# EAGLE design 7_cpu_registers_b (EAGLE 6.6.0)

## Sheet 1 of 2
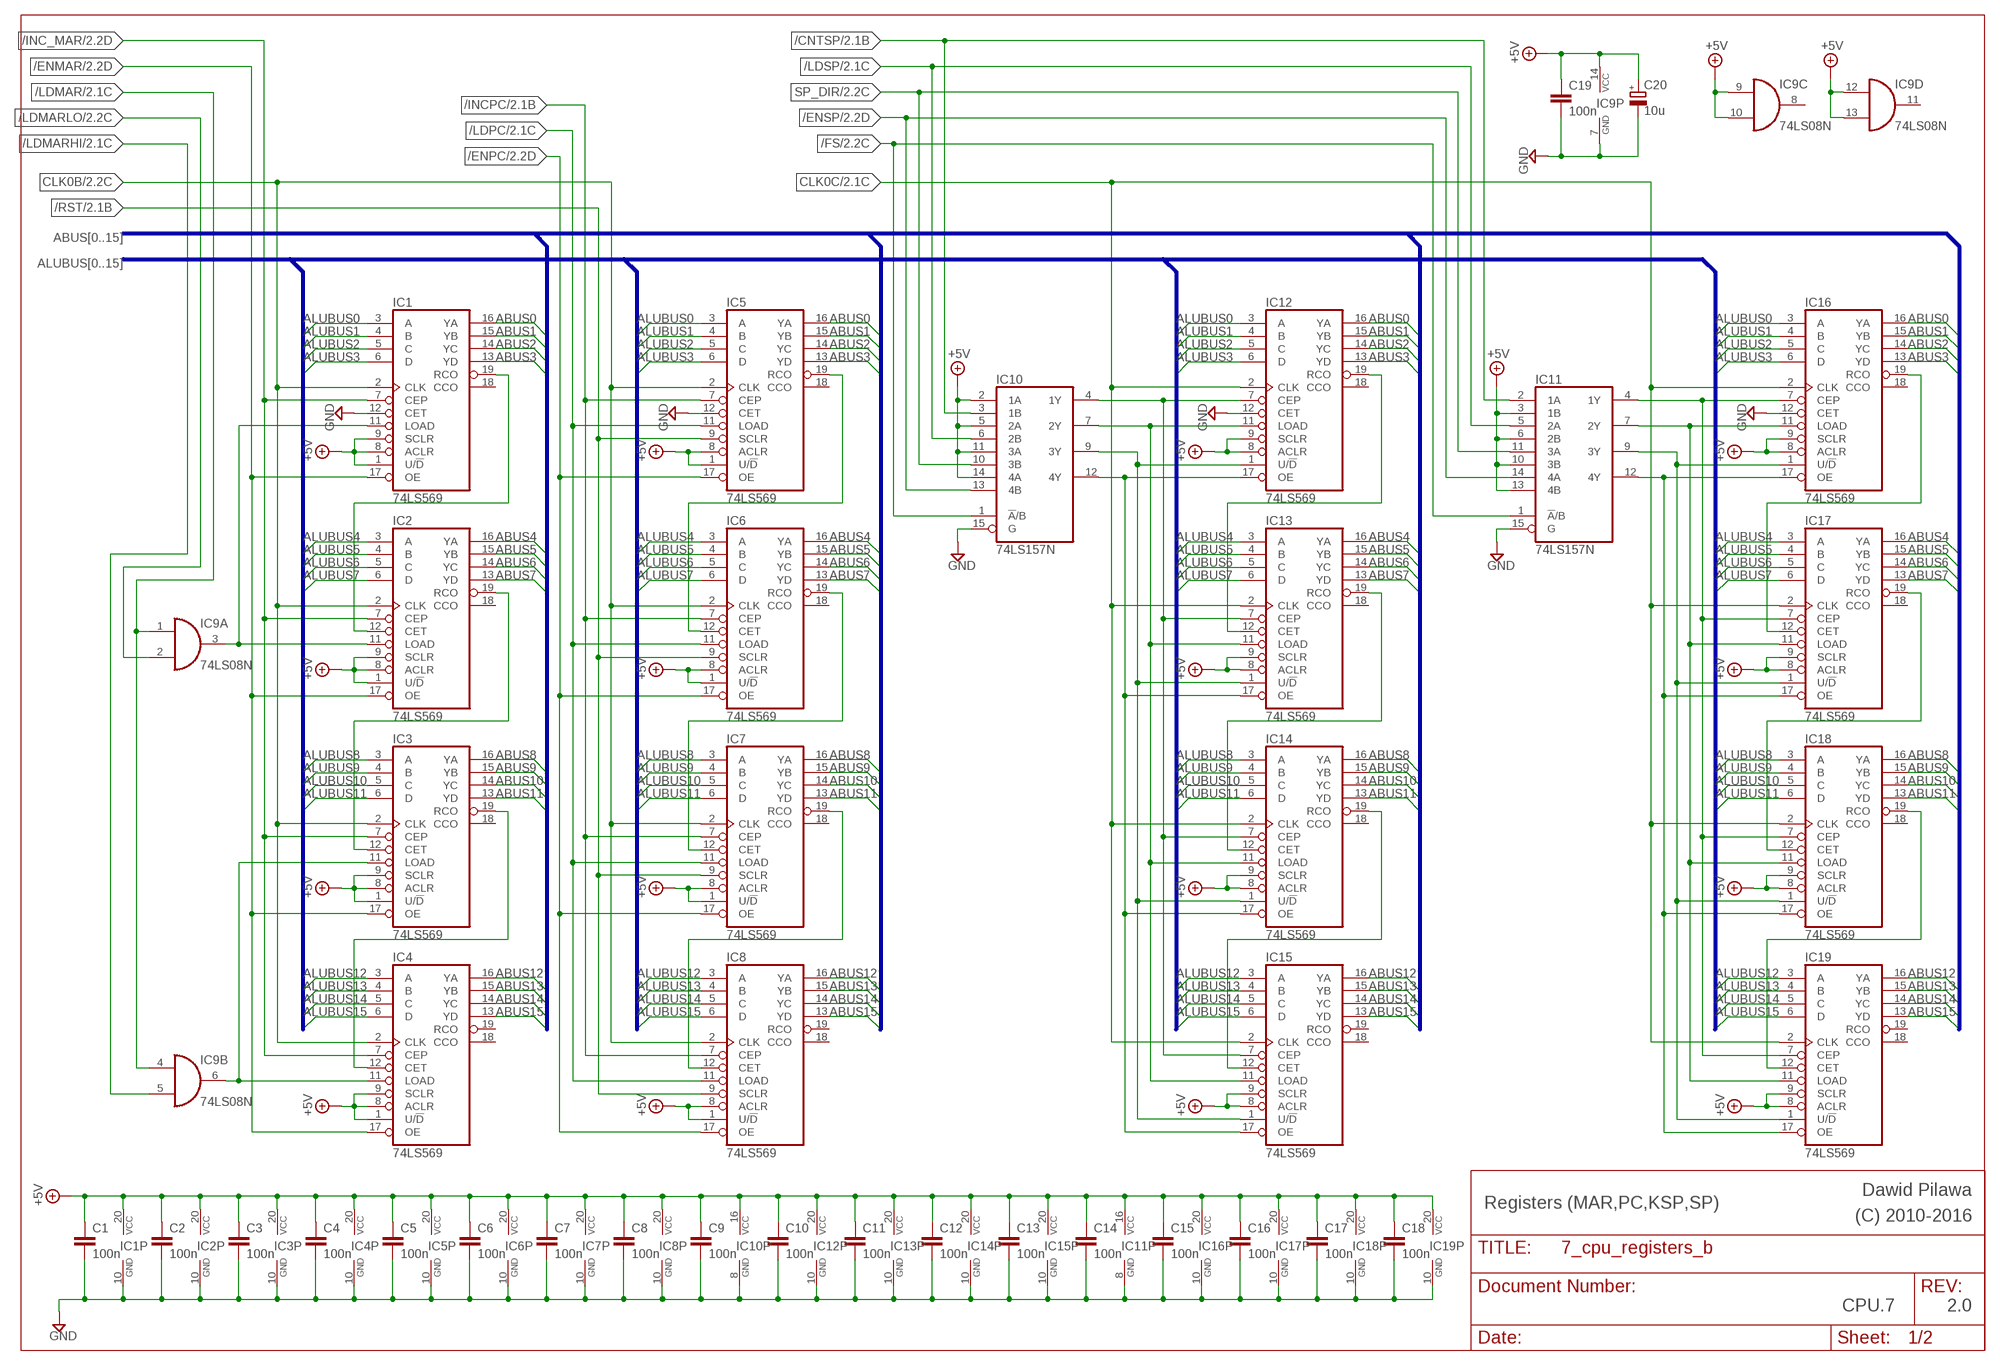
[diagram p0: schematic, sheet 1]

### Parts
C1  100n  C-EU050-024X044  [C050-024X044]
C2  100n  C-EU050-024X044  [C050-024X044]
C3  100n  C-EU050-024X044  [C050-024X044]
C4  100n  C-EU050-024X044  [C050-024X044]
C5  100n  C-EU050-024X044  [C050-024X044]
C6  100n  C-EU050-024X044  [C050-024X044]
C7  100n  C-EU050-024X044  [C050-024X044]
C8  100n  C-EU050-024X044  [C050-024X044]
C9  100n  C-EU050-024X044  [C050-024X044]
C10  100n  C-EU050-024X044  [C050-024X044]
C11  100n  C-EU050-024X044  [C050-024X044]
C12  100n  C-EU050-024X044  [C050-024X044]
C13  100n  C-EU050-024X044  [C050-024X044]
C14  100n  C-EU050-024X044  [C050-024X044]
C15  100n  C-EU050-024X044  [C050-024X044]
C16  100n  C-EU050-024X044  [C050-024X044]
C17  100n  C-EU050-024X044  [C050-024X044]
C18  100n  C-EU050-024X044  [C050-024X044]
C19  100n  C-EU050-024X044  [C050-024X044]
C20  10u  CPOL-EUE2.5-6  [E2,5-6]
IC1  74LS569  [DIL20]
IC2  74LS569  [DIL20]
IC3  74LS569  [DIL20]
IC4  74LS569  [DIL20]
IC5  74LS569  [DIL20]
IC6  74LS569  [DIL20]
IC7  74LS569  [DIL20]
IC8  74LS569  [DIL20]
IC9  74LS08N  [DIL14]
IC10  74LS157N  [DIL16]
IC11  74LS157N  [DIL16]
IC12  74LS569  [DIL20]
IC13  74LS569  [DIL20]
IC14  74LS569  [DIL20]
IC15  74LS569  [DIL20]
IC16  74LS569  [DIL20]
IC17  74LS569  [DIL20]
IC18  74LS569  [DIL20]
IC19  74LS569  [DIL20]

### Nets
+5V: C1.1 C2.1 C3.1 C4.1 C5.1 C6.1 C7.1 C8.1 C9.1 C10.1 C11.1 C12.1 C13.1 C14.1 C15.1 C16.1 C17.1 C18.1 C19.1 C20.+ IC1.1(U/!D) IC1.8(ACLR) IC1.9(SCLR) IC1.20(VCC) IC2.1(U/!D) IC2.8(ACLR) IC2.9(SCLR) IC2.20(VCC) IC3.1(U/!D) IC3.8(ACLR) IC3.9(SCLR) IC3.20(VCC) IC4.1(U/!D) IC4.8(ACLR) IC4.9(SCLR) IC4.20(VCC) IC5.1(U/!D) IC5.8(ACLR) IC5.20(VCC) IC6.1(U/!D) IC6.8(ACLR) IC6.20(VCC) IC7.1(U/!D) IC7.8(ACLR) IC7.20(VCC) IC8.1(U/!D) IC8.8(ACLR) IC8.20(VCC) IC9.9(C:I0) IC9.10(C:I1) IC9.12(D:I0) IC9.13(D:I1) IC9.14(P:VCC) IC10.2(1A) IC10.5(2A) IC10.11(3A) IC10.14(4A) IC10.16(VCC) IC11.3(1B) IC11.6(2B) IC11.10(3B) IC11.13(4B) IC11.16(VCC) IC12.8(ACLR) IC12.9(SCLR) IC12.20(VCC) IC13.8(ACLR) IC13.9(SCLR) IC13.20(VCC) IC14.8(ACLR) IC14.9(SCLR) IC14.20(VCC) IC15.8(ACLR) IC15.9(SCLR) IC15.20(VCC) IC16.8(ACLR) IC16.9(SCLR) IC16.20(VCC) IC17.8(ACLR) IC17.9(SCLR) IC17.20(VCC) IC18.8(ACLR) IC18.9(SCLR) IC18.20(VCC) IC19.8(ACLR) IC19.9(SCLR) IC19.20(VCC) ; also sheet 2
/CNTSP: IC10.3(1B) IC11.2(1A) ; also sheet 2
/ENMAR: IC1.17(OE) IC2.17(OE) IC3.17(OE) IC4.17(OE) ; also sheet 2
/ENPC: IC5.17(OE) IC6.17(OE) IC7.17(OE) IC8.17(OE) ; also sheet 2
/ENSP: IC10.13(4B) IC11.14(4A) ; also sheet 2
/FS: IC10.1(!A!/B) IC11.1(!A!/B) ; also sheet 2
/INC_MAR: IC1.7(CEP) IC2.7(CEP) IC3.7(CEP) IC4.7(CEP) ; also sheet 2
/INCPC: IC5.7(CEP) IC6.7(CEP) IC7.7(CEP) IC8.7(CEP) ; also sheet 2
/LDMAR: IC9.1(A:I0) IC9.4(B:I0) ; also sheet 2
/LDMARHI: IC9.5(B:I1) ; also sheet 2
/LDMARLO: IC9.2(A:I1) ; also sheet 2
/LDPC: IC5.11(LOAD) IC6.11(LOAD) IC7.11(LOAD) IC8.11(LOAD) ; also sheet 2
/LDSP: IC10.6(2B) IC11.5(2A) ; also sheet 2
/RST: IC5.9(SCLR) IC6.9(SCLR) IC7.9(SCLR) IC8.9(SCLR) ; also sheet 2
ABUS0: IC1.16(YA) IC5.16(YA) IC12.16(YA) IC16.16(YA) ; also sheet 2
ABUS1: IC1.15(YB) IC5.15(YB) IC12.15(YB) IC16.15(YB) ; also sheet 2
ABUS2: IC1.14(YC) IC5.14(YC) IC12.14(YC) IC16.14(YC) ; also sheet 2
ABUS3: IC1.13(YD) IC5.13(YD) IC12.13(YD) IC16.13(YD) ; also sheet 2
ABUS4: IC2.16(YA) IC6.16(YA) IC13.16(YA) IC17.16(YA) ; also sheet 2
ABUS5: IC2.15(YB) IC6.15(YB) IC13.15(YB) IC17.15(YB) ; also sheet 2
ABUS6: IC2.14(YC) IC6.14(YC) IC13.14(YC) IC17.14(YC) ; also sheet 2
ABUS7: IC2.13(YD) IC6.13(YD) IC13.13(YD) IC17.13(YD) ; also sheet 2
ABUS8: IC3.16(YA) IC7.16(YA) IC14.16(YA) IC18.16(YA) ; also sheet 2
ABUS9: IC3.15(YB) IC7.15(YB) IC14.15(YB) IC18.15(YB) ; also sheet 2
ABUS10: IC3.14(YC) IC7.14(YC) IC14.14(YC) IC18.14(YC) ; also sheet 2
ABUS11: IC3.13(YD) IC7.13(YD) IC14.13(YD) IC18.13(YD) ; also sheet 2
ABUS12: IC4.16(YA) IC8.16(YA) IC15.16(YA) IC19.16(YA) ; also sheet 2
ABUS13: IC4.15(YB) IC8.15(YB) IC15.15(YB) IC19.15(YB) ; also sheet 2
ABUS14: IC4.14(YC) IC8.14(YC) IC15.14(YC) IC19.14(YC) ; also sheet 2
ABUS15: IC4.13(YD) IC8.13(YD) IC15.13(YD) IC19.13(YD) ; also sheet 2
ALUBUS0: IC1.3(A) IC5.3(A) IC12.3(A) IC16.3(A) ; also sheet 2
ALUBUS1: IC1.4(B) IC5.4(B) IC12.4(B) IC16.4(B) ; also sheet 2
ALUBUS2: IC1.5(C) IC5.5(C) IC12.5(C) IC16.5(C) ; also sheet 2
ALUBUS3: IC1.6(D) IC5.6(D) IC12.6(D) IC16.6(D) ; also sheet 2
ALUBUS4: IC2.3(A) IC6.3(A) IC13.3(A) IC17.3(A) ; also sheet 2
ALUBUS5: IC2.4(B) IC6.4(B) IC13.4(B) IC17.4(B) ; also sheet 2
ALUBUS6: IC2.5(C) IC6.5(C) IC13.5(C) IC17.5(C) ; also sheet 2
ALUBUS7: IC2.6(D) IC6.6(D) IC13.6(D) IC17.6(D) ; also sheet 2
ALUBUS8: IC3.3(A) IC7.3(A) IC14.3(A) IC18.3(A) ; also sheet 2
ALUBUS9: IC3.4(B) IC7.4(B) IC14.4(B) IC18.4(B) ; also sheet 2
ALUBUS10: IC3.5(C) IC7.5(C) IC14.5(C) IC18.5(C) ; also sheet 2
ALUBUS11: IC3.6(D) IC7.6(D) IC14.6(D) IC18.6(D) ; also sheet 2
ALUBUS12: IC4.3(A) IC8.3(A) IC15.3(A) IC19.3(A) ; also sheet 2
ALUBUS13: IC4.4(B) IC8.4(B) IC15.4(B) IC19.4(B) ; also sheet 2
ALUBUS14: IC4.5(C) IC8.5(C) IC15.5(C) IC19.5(C) ; also sheet 2
ALUBUS15: IC4.6(D) IC8.6(D) IC15.6(D) IC19.6(D) ; also sheet 2
CLK0B: IC1.2(CLK) IC2.2(CLK) IC3.2(CLK) IC4.2(CLK) IC5.2(CLK) IC6.2(CLK) IC7.2(CLK) IC8.2(CLK) ; also sheet 2
CLK0C: IC12.2(CLK) IC13.2(CLK) IC14.2(CLK) IC15.2(CLK) IC16.2(CLK) IC17.2(CLK) IC18.2(CLK) IC19.2(CLK) ; also sheet 2
GND: C1.2 C2.2 C3.2 C4.2 C5.2 C6.2 C7.2 C8.2 C9.2 C10.2 C11.2 C12.2 C13.2 C14.2 C15.2 C16.2 C17.2 C18.2 C19.2 C20.- IC1.10(GND) IC1.12(CET) IC2.10(GND) IC3.10(GND) IC4.10(GND) IC5.10(GND) IC5.12(CET) IC6.10(GND) IC7.10(GND) IC8.10(GND) IC9.7(P:GND) IC10.8(GND) IC10.15(G) IC11.8(GND) IC11.15(G) IC12.10(GND) IC12.12(CET) IC13.10(GND) IC14.10(GND) IC15.10(GND) IC16.10(GND) IC16.12(CET) IC17.10(GND) IC18.10(GND) IC19.10(GND) ; also sheet 2
N$1: IC1.11(LOAD) IC2.11(LOAD) IC9.3(A:O)
N$2: IC6.19(RCO) IC7.12(CET)
N$3: IC5.19(RCO) IC6.12(CET)
N$4: IC7.19(RCO) IC8.12(CET)
N$5: IC12.19(RCO) IC13.12(CET)
N$6: IC13.19(RCO) IC14.12(CET)
N$7: IC3.11(LOAD) IC4.11(LOAD) IC9.6(B:O)
N$8: IC14.19(RCO) IC15.12(CET)
N$9: IC10.4(1Y) IC12.7(CEP) IC13.7(CEP) IC14.7(CEP) IC15.7(CEP)
N$10: IC1.19(RCO) IC2.12(CET)
N$11: IC2.19(RCO) IC3.12(CET)
N$12: IC3.19(RCO) IC4.12(CET)
N$13: IC10.7(2Y) IC12.11(LOAD) IC13.11(LOAD) IC14.11(LOAD) IC15.11(LOAD)
N$14: IC10.9(3Y) IC12.1(U/!D) IC13.1(U/!D) IC14.1(U/!D) IC15.1(U/!D)
N$15: IC11.9(3Y) IC16.1(U/!D) IC17.1(U/!D) IC18.1(U/!D) IC19.1(U/!D)
N$16: IC10.12(4Y) IC12.17(OE) IC13.17(OE) IC14.17(OE) IC15.17(OE)
N$17: IC11.12(4Y) IC16.17(OE) IC17.17(OE) IC18.17(OE) IC19.17(OE)
N$19: IC16.19(RCO) IC17.12(CET)
N$20: IC17.19(RCO) IC18.12(CET)
N$21: IC18.19(RCO) IC19.12(CET)
N$23: IC11.4(1Y) IC16.7(CEP) IC17.7(CEP) IC18.7(CEP) IC19.7(CEP)
N$24: IC11.7(2Y) IC16.11(LOAD) IC17.11(LOAD) IC18.11(LOAD) IC19.11(LOAD)
SP_DIR: IC10.10(3B) IC11.11(3A) ; also sheet 2
Unconnected: IC1.18(CCO) IC2.18(CCO) IC3.18(CCO) IC4.18(CCO) IC4.19(RCO) IC5.18(CCO) IC6.18(CCO) IC7.18(CCO) IC8.18(CCO) IC8.19(RCO) IC9.8(C:O) IC9.11(D:O) IC12.18(CCO) IC13.18(CCO) IC14.18(CCO) IC15.18(CCO) IC15.19(RCO) IC16.18(CCO) IC17.18(CCO) IC18.18(CCO) IC19.18(CCO) IC19.19(RCO)

### Buses
ALUBUS[0..15]
ABUS[0..15]

### Notes on the sheet
- Dawid Pilawa
- Registers (MAR,PC,KSP,SP) | (C) 2010-2016
- CPU.7 | 2.0

## Sheet 2 of 2
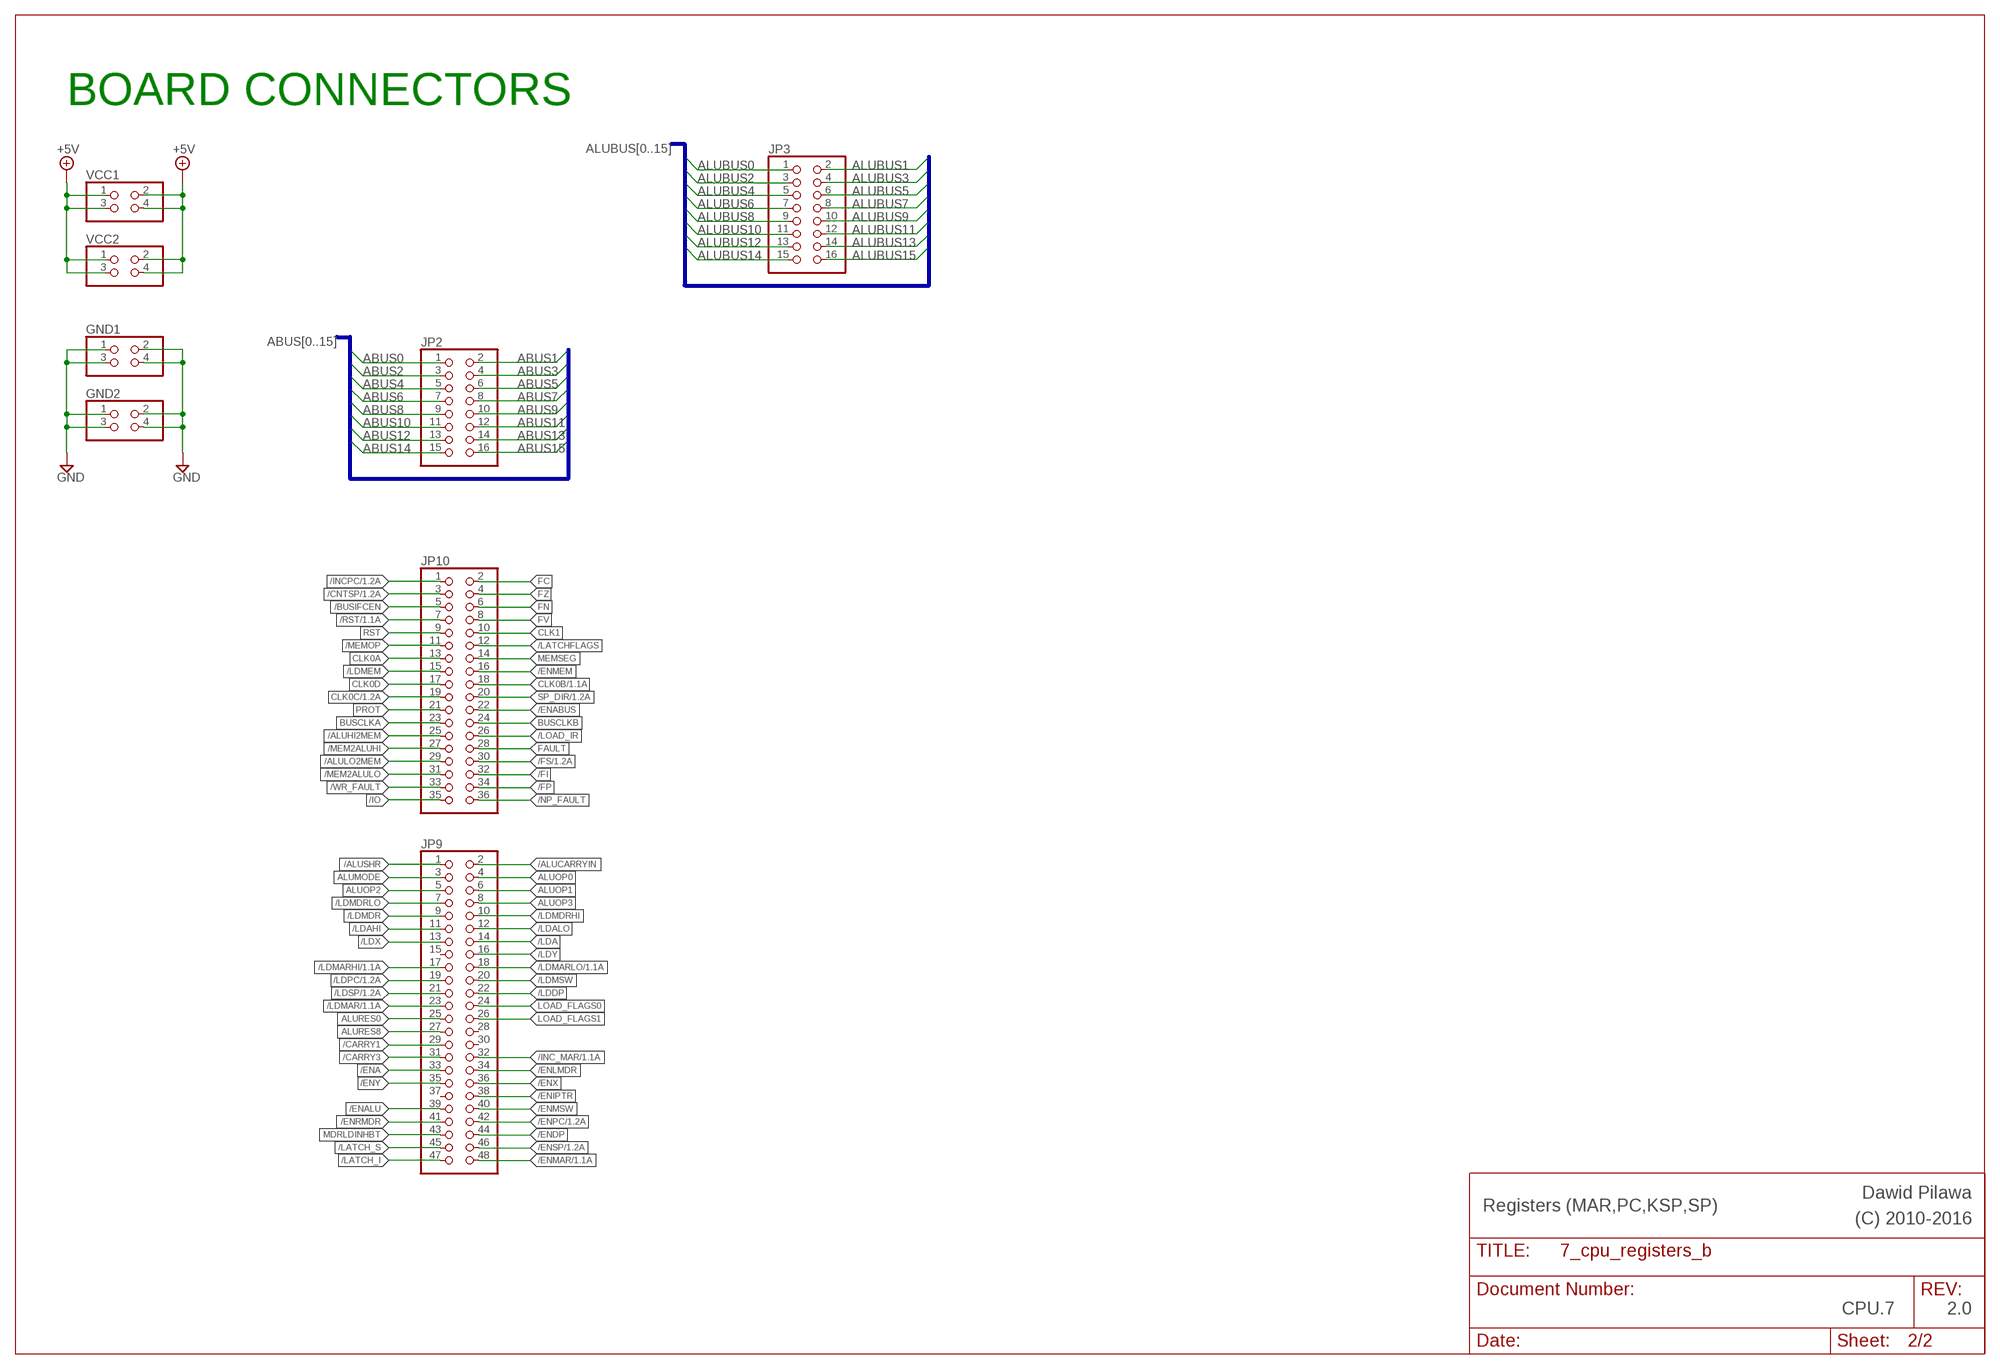
[diagram p1: schematic, sheet 2]

### Parts
GND1  PINHD-2X2  [2X02]
GND2  PINHD-2X2  [2X02]
JP2  PINHD-2X8  [2X08]
JP3  PINHD-2X8  [2X08]
JP9  PINHD-2X24  [2X24]
JP10  PINHD-2X18  [2X18]
VCC1  PINHD-2X2  [2X02]
VCC2  PINHD-2X2  [2X02]

### Nets
+5V: VCC1.1 VCC1.2 VCC1.3 VCC1.4 VCC2.1 VCC2.2 VCC2.3 VCC2.4 ; also sheet 1
/ALUCARRYIN: JP9.2
/ALUHI2MEM: JP10.25
/ALULO2MEM: JP10.29
/ALUSHR: JP9.1
/BUSIFCEN: JP10.5
/CARRY1: JP9.29
/CARRY3: JP9.31
/CNTSP: JP10.3 ; also sheet 1
/ENA: JP9.33
/ENABUS: JP10.22
/ENALU: JP9.39
/ENDP: JP9.44
/ENIPTR: JP9.38
/ENLMDR: JP9.34
/ENMAR: JP9.48 ; also sheet 1
/ENMEM: JP10.16
/ENMSW: JP9.40
/ENPC: JP9.42 ; also sheet 1
/ENRMDR: JP9.41
/ENSP: JP9.46 ; also sheet 1
/ENX: JP9.36
/ENY: JP9.35
/FI: JP10.32
/FP: JP10.34
/FS: JP10.30 ; also sheet 1
/INC_MAR: JP9.32 ; also sheet 1
/INCPC: JP10.1 ; also sheet 1
/IO: JP10.35
/LATCH_I: JP9.47
/LATCH_S: JP9.45
/LATCHFLAGS: JP10.12
/LDA: JP9.14
/LDAHI: JP9.11
/LDALO: JP9.12
/LDDP: JP9.22
/LDMAR: JP9.23 ; also sheet 1
/LDMARHI: JP9.17 ; also sheet 1
/LDMARLO: JP9.18 ; also sheet 1
/LDMDR: JP9.9
/LDMDRHI: JP9.10
/LDMDRLO: JP9.7
/LDMEM: JP10.15
/LDMSW: JP9.20
/LDPC: JP9.19 ; also sheet 1
/LDSP: JP9.21 ; also sheet 1
/LDX: JP9.13
/LDY: JP9.16
/LOAD_IR: JP10.26
/MEM2ALUHI: JP10.27
/MEM2ALULO: JP10.31
/MEMOP: JP10.11
/NP_FAULT: JP10.36
/RST: JP10.7 ; also sheet 1
/WR_FAULT: JP10.33
ABUS0: JP2.1 ; also sheet 1
ABUS1: JP2.2 ; also sheet 1
ABUS2: JP2.3 ; also sheet 1
ABUS3: JP2.4 ; also sheet 1
ABUS4: JP2.5 ; also sheet 1
ABUS5: JP2.6 ; also sheet 1
ABUS6: JP2.7 ; also sheet 1
ABUS7: JP2.8 ; also sheet 1
ABUS8: JP2.9 ; also sheet 1
ABUS9: JP2.10 ; also sheet 1
ABUS10: JP2.11 ; also sheet 1
ABUS11: JP2.12 ; also sheet 1
ABUS12: JP2.13 ; also sheet 1
ABUS13: JP2.14 ; also sheet 1
ABUS14: JP2.15 ; also sheet 1
ABUS15: JP2.16 ; also sheet 1
ALUBUS0: JP3.1 ; also sheet 1
ALUBUS1: JP3.2 ; also sheet 1
ALUBUS2: JP3.3 ; also sheet 1
ALUBUS3: JP3.4 ; also sheet 1
ALUBUS4: JP3.5 ; also sheet 1
ALUBUS5: JP3.6 ; also sheet 1
ALUBUS6: JP3.7 ; also sheet 1
ALUBUS7: JP3.8 ; also sheet 1
ALUBUS8: JP3.9 ; also sheet 1
ALUBUS9: JP3.10 ; also sheet 1
ALUBUS10: JP3.11 ; also sheet 1
ALUBUS11: JP3.12 ; also sheet 1
ALUBUS12: JP3.13 ; also sheet 1
ALUBUS13: JP3.14 ; also sheet 1
ALUBUS14: JP3.15 ; also sheet 1
ALUBUS15: JP3.16 ; also sheet 1
ALUMODE: JP9.3
ALUOP0: JP9.4
ALUOP1: JP9.6
ALUOP2: JP9.5
ALUOP3: JP9.8
ALURES0: JP9.25
ALURES8: JP9.27
BUSCLKA: JP10.23
BUSCLKB: JP10.24
CLK0A: JP10.13
CLK0B: JP10.18 ; also sheet 1
CLK0C: JP10.19 ; also sheet 1
CLK0D: JP10.17
CLK1: JP10.10
FAULT: JP10.28
FC: JP10.2
FN: JP10.6
FV: JP10.8
FZ: JP10.4
GND: GND1.1 GND1.2 GND1.3 GND1.4 GND2.1 GND2.2 GND2.3 GND2.4 ; also sheet 1
LOAD_FLAGS0: JP9.24
LOAD_FLAGS1: JP9.26
MDRLDINHBT: JP9.43
MEMSEG: JP10.14
PROT: JP10.21
RST: JP10.9
SP_DIR: JP10.20 ; also sheet 1
Unconnected: JP9.15 JP9.28 JP9.30 JP9.37

### Buses
ALUBUS[0..15]
ABUS[0..15]

### Notes on the sheet
- BOARD CONNECTORS
- Dawid Pilawa
- Registers (MAR,PC,KSP,SP) | (C) 2010-2016
- CPU.7 | 2.0

## Library data of the parts
C1-C19 = rcl:C-EU: CAPACITOR, European symbol
C20 = rcl:CPOL-EU: POLARIZED CAPACITOR, European symbol
GND1 GND2 VCC1 VCC2 = pinhead:PINHD-2X2: PIN HEADER
IC1-IC8 IC12-IC19 = 74xx-eu:74*569: Synchronous binary up/down counter with three-state outputs
IC9 = 74xx-eu:74*08: Quad 2-input AND gate
IC10 IC11 = 74xx-eu:74*157: Quadruple 2-line to 1-line data SELECTOR/MULTIPLEXER
JP2 JP3 = pinhead:PINHD-2X8: PIN HEADER
JP9 = pinhead:PINHD-2X24: PIN HEADER
JP10 = pinhead:PINHD-2X18: PIN HEADER

## Board
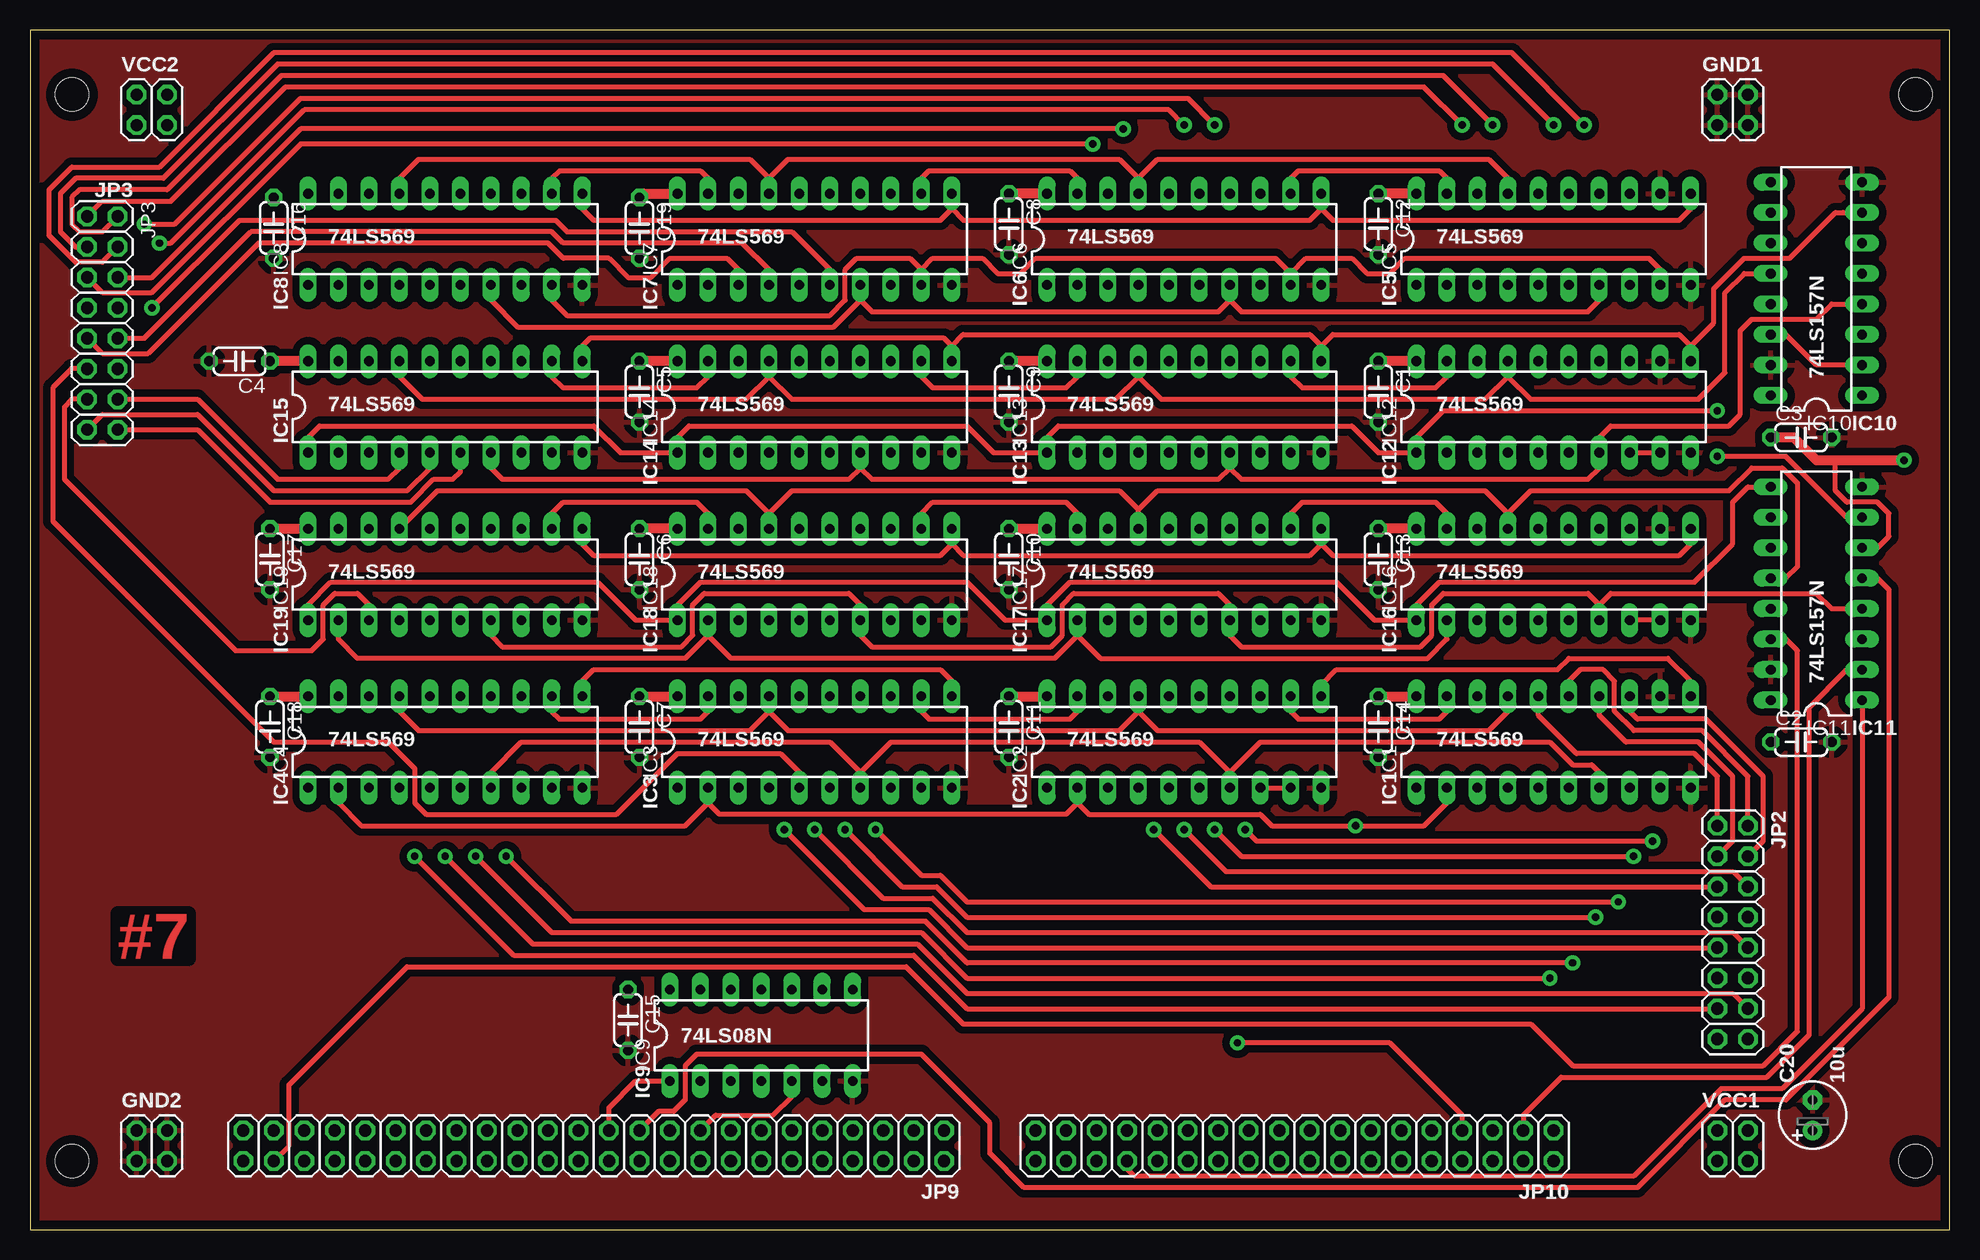
[diagram p2: board, top side]
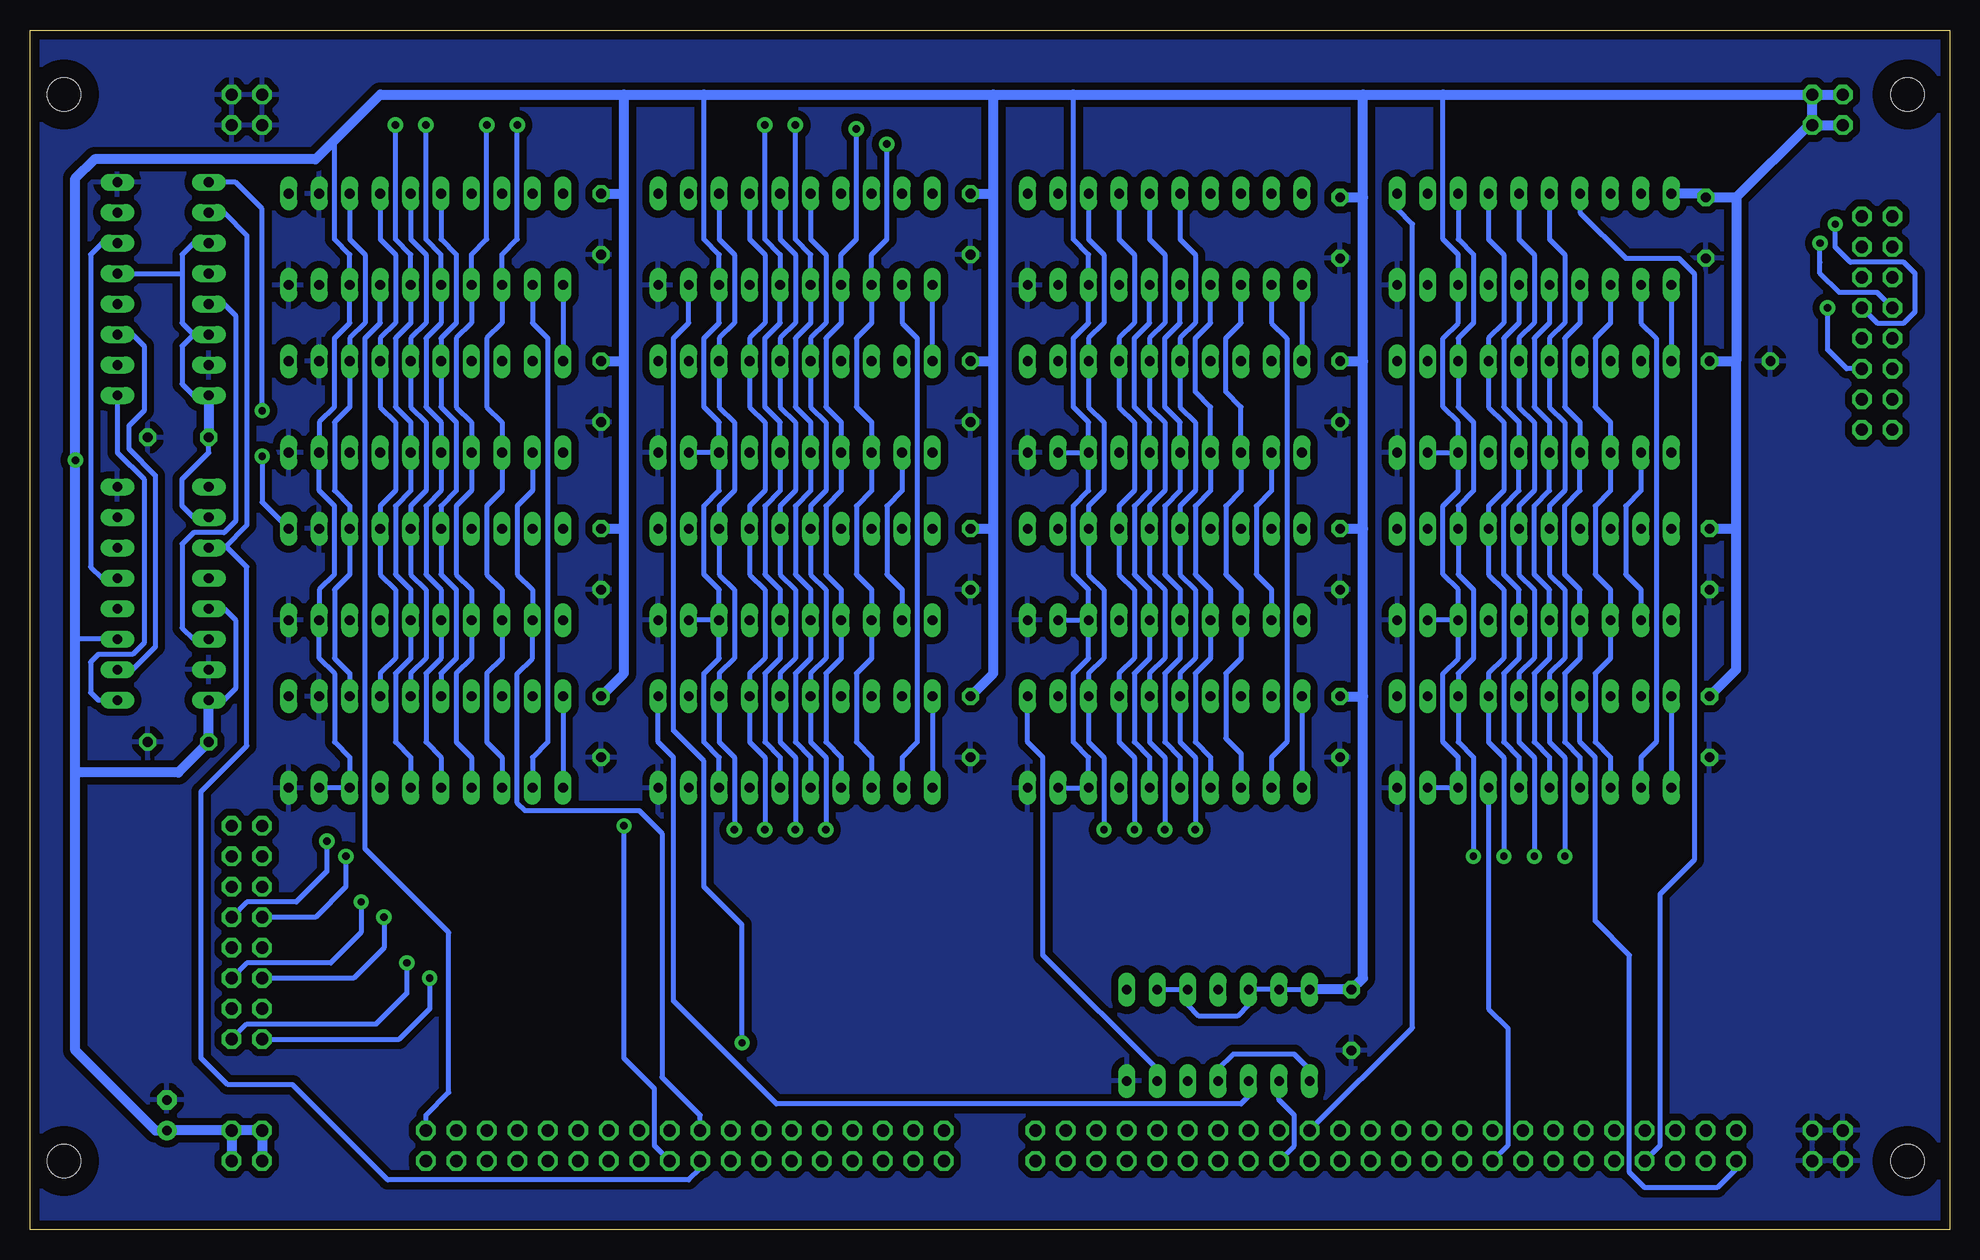
[diagram p3: board, bottom side, seen from below]

Size 160 x 100 mm. Coordinates in mm from the lower left corner, seen from the top.
Outline: 0,0 160,0 160,100 0,100 0,0
Copper layers (1*16): Top 0.035mm / dielectric 1.5mm / Bottom 0.035mm
Design rules "homebrew_pcb": minimum track width 16mil, minimum drill 24mil, track to track 16mil, track to pad 10mil, pad to pad 10mil, via to via 10mil, smd to smd 8mil, copper to edge 30mil, drill to drill 10mil, minimum pad ring 12mil, minimum via ring 12mil, stop-mask expansion 4mil, vias tented up to drill 0mil, thermal gap 24mil
Holes 2.79 mm at 3.49,94.61 3.49,5.71 157.16,5.71 157.16,94.61
bRestrict: area 1.2,92.3 to 5.8,96.9; area 154.9,92.3 to 159.4,96.9; area 154.9,3.4 to 159.4,8; area 1.2,3.4 to 5.8,8
vRestrict: area 1.2,92.3 to 5.8,96.9; area 154.9,92.3 to 159.4,96.9; area 154.9,3.4 to 159.4,8; area 1.2,3.4 to 5.8,8

### Footprints (pad centres in the part's own frame; a part is rotated, then mirrored left to right if it is on the bottom)
C050-024X044 = drill 0.813 octagon: 1 -2.54,0; 2 2.54,0
E2,5-6 = drill 0.813 pad 1.6: + -1.27,0 | drill 0.813 pad 1.6 octagon: - 1.27,0
2X02 = drill 1.016 octagon: 1 -1.27,-1.27; 2 -1.27,1.27; 3 1.27,-1.27; 4 1.27,1.27
DIL20 = drill 0.813 long: 1 -11.43,-3.81; 2 -8.89,-3.81; 3 -6.35,-3.81; 4 -3.81,-3.81; 5 -1.27,-3.81; 6 1.27,-3.81; 7 3.81,-3.81; 8 6.35,-3.81; 9 8.89,-3.81; 10 11.43,-3.81; 11 11.43,3.81; 12 8.89,3.81; 13 6.35,3.81; 14 3.81,3.81; 15 1.27,3.81; 16 -1.27,3.81; 17 -3.81,3.81; 18 -6.35,3.81; 19 -8.89,3.81; 20 -11.43,3.81
DIL14 = drill 0.813 long: 1 -7.62,-3.81; 2 -5.08,-3.81; 3 -2.54,-3.81; 4 0,-3.81; 5 2.54,-3.81; 6 5.08,-3.81; 7 7.62,-3.81; 8 7.62,3.81; 9 5.08,3.81; 10 2.54,3.81; 11 0,3.81; 12 -2.54,3.81; 13 -5.08,3.81; 14 -7.62,3.81
DIL16 = drill 0.813 long: 1 -8.89,-3.81; 2 -6.35,-3.81; 3 -3.81,-3.81; 4 -1.27,-3.81; 5 1.27,-3.81; 6 3.81,-3.81; 7 6.35,-3.81; 8 8.89,-3.81; 9 8.89,3.81; 10 6.35,3.81; 11 3.81,3.81; 12 1.27,3.81; 13 -1.27,3.81; 14 -3.81,3.81; 15 -6.35,3.81; 16 -8.89,3.81
2X08 = drill 1.016 octagon: 1 -8.89,-1.27; 2 -8.89,1.27; 3 -6.35,-1.27; 4 -6.35,1.27; 5 -3.81,-1.27; 6 -3.81,1.27; 7 -1.27,-1.27; 8 -1.27,1.27; 9 1.27,-1.27; 10 1.27,1.27; 11 3.81,-1.27; 12 3.81,1.27; 13 6.35,-1.27; 14 6.35,1.27; 15 8.89,-1.27; 16 8.89,1.27
2X24 = drill 1.016 octagon: 1 -27.94,-1.27; 2 -27.94,1.27; 3 -25.4,-1.27; 4 -25.4,1.27; 5 -22.86,-1.27; 6 -22.86,1.27; 7 -20.32,-1.27; 8 -20.32,1.27; 9 -17.78,-1.27; 10 -17.78,1.27; 11 -15.24,-1.27; 12 -15.24,1.27; 13 -12.7,-1.27; 14 -12.7,1.27; 15 -10.16,-1.27; 16 -10.16,1.27; 17 -7.62,-1.27; 18 -7.62,1.27; 19 -5.08,-1.27; 20 -5.08,1.27; 21 -2.54,-1.27; 22 -2.54,1.27; 23 0,-1.27; 24 0,1.27; 25 2.54,-1.27; 26 2.54,1.27; 27 5.08,-1.27; 28 5.08,1.27; 29 7.62,-1.27; 30 7.62,1.27; 31 10.16,-1.27; 32 10.16,1.27; 33 12.7,-1.27; 34 12.7,1.27; 35 15.24,-1.27; 36 15.24,1.27; 37 17.78,-1.27; 38 17.78,1.27; 39 20.32,-1.27; 40 20.32,1.27; 41 22.86,-1.27; 42 22.86,1.27; 43 25.4,-1.27; 44 25.4,1.27; 45 27.94,-1.27; 46 27.94,1.27; 47 30.48,-1.27; 48 30.48,1.27
2X18 = drill 1.016 octagon: 1 -21.59,-1.27; 2 -21.59,1.27; 3 -19.05,-1.27; 4 -19.05,1.27; 5 -16.51,-1.27; 6 -16.51,1.27; 7 -13.97,-1.27; 8 -13.97,1.27; 9 -11.43,-1.27; 10 -11.43,1.27; 11 -8.89,-1.27; 12 -8.89,1.27; 13 -6.35,-1.27; 14 -6.35,1.27; 15 -3.81,-1.27; 16 -3.81,1.27; 17 -1.27,-1.27; 18 -1.27,1.27; 19 1.27,-1.27; 20 1.27,1.27; 21 3.81,-1.27; 22 3.81,1.27; 23 6.35,-1.27; 24 6.35,1.27; 25 8.89,-1.27; 26 8.89,1.27; 27 11.43,-1.27; 28 11.43,1.27; 29 13.97,-1.27; 30 13.97,1.27; 31 16.51,-1.27; 32 16.51,1.27; 33 19.05,-1.27; 34 19.05,1.27; 35 21.59,-1.27; 36 21.59,1.27

### Placement (x,y rotation side)
C1  112.39,69.85 270 top
C2  147.64,40.64 0 top
C3  147.64,66.04 0 top
C4  17.46,72.39 180 top
C5  50.8,69.85 270 top
C6  50.8,55.88 270 top
C7  50.8,41.91 270 top
C8  81.6,83.82 270 top
C9  81.6,69.85 270 top
C10  81.6,55.88 270 top
C11  81.6,41.91 270 top
C12  112.39,83.82 270 top
C13  112.39,55.88 270 top
C14  112.39,41.91 270 top
C15  49.85,17.46 270 top
C16  20.32,83.5 270 top
C17  20,55.88 270 top
C18  20,41.91 270 top
C19  50.8,83.5 270 top
C20  148.59,9.53 90 top
GND1  141.92,93.34 0 top
GND2  10.16,6.99 0 top
IC1  127,40.64 0 top
IC2  96.2,40.64 0 top
IC3  65.41,40.64 0 top
IC4  34.61,40.64 0 top
IC5  127,82.55 0 top
IC6  96.2,82.55 0 top
IC7  65.41,82.55 0 top
IC8  34.61,82.55 0 top
IC9  60.96,16.19 0 top
IC10  148.91,78.42 90 top
IC11  148.91,53.02 90 top
IC12  127,68.58 0 top
IC13  96.2,68.58 0 top
IC14  65.41,68.58 0 top
IC15  34.61,68.58 0 top
IC16  127,54.61 0 top
IC17  96.2,54.61 0 top
IC18  65.41,54.61 0 top
IC19  34.61,54.61 0 top
JP2  141.92,24.77 270 top
JP3  6.03,75.56 270 top
JP9  48.26,6.99 180 top
JP10  105.41,6.99 180 top
VCC1  141.92,6.99 0 top
VCC2  10.16,93.34 0 top

### Tracks (layer width: path | path; a pad name or v marks a point on that pad's centre or on a via)
+5V  (via drill 0.61 pad 1.27)
  Top 0.406: IC2.8 IC2.9 | IC12.8 IC12.9 | IC16.9 IC16.8 | IC10.2 148.91,72.07 146.37,74.61 IC10.14 | IC11.6 153.99,56.83 154.94,57.78 154.94,59.69 153.99,60.64 151.45,60.64 150.5,61.59 150.5,64.14
  Top 0.813: IC6.20 C8.1 | IC5.20 C12.1 | C19.1 51.12,86.36 IC7.20 | IC14.20 C5.1 | IC18.20 C6.1 | C7.1 IC3.20 | IC13.20 C9.1 | C10.1 IC17.20 | C11.1 IC2.20 | IC12.20 C1.1 | IC16.20 C13.1 | C14.1 IC1.20 | v156.21,64.14 150.5,64.14 148.91,64.14 147,66.04 C3.1 | IC15.20 C4.1 | C18.1 IC4.20 | C17.1 IC19.20
  Bottom 0.406: 73.03,94.61 73.03,82.55 71.75,81.28 IC7.8 71.75,75.56 73.03,74.3 73.03,68.58 71.75,67.31 IC14.8 | 42.23,94.61 42.23,82.55 40.96,81.28 IC8.8 40.96,75.56 42.23,74.3 42.23,68.58 40.96,67.31 IC15.8 | IC19.8 40.96,53.34 42.23,54.61 42.23,60.33 40.96,61.59 IC15.8 | IC19.8 40.96,47.62 42.23,46.35 42.23,40.64 40.96,39.37 IC4.8 IC4.9 | IC8.1 IC15.20 | IC7.1 IC14.20 | IC13.20 IC6.1 | IC5.1 IC12.20 | IC4.20 IC4.1 | IC3.20 IC3.1 | IC2.20 IC2.1 | IC1.20 IC1.1 | IC14.9 IC14.8 | IC18.9 IC18.8 | IC18.8 71.75,53.34 73.03,54.61 73.03,60.33 71.75,61.59 IC14.8 | IC3.9 IC3.8 71.75,39.37 73.03,40.64 73.03,46.35 71.75,47.62 IC18.8 | 103.82,94.61 103.82,82.55 102.55,81.28 IC6.8 102.55,75.56 103.82,74.3 103.82,68.58 102.55,67.31 IC13.8 | IC17.8 102.55,53.34 103.82,54.61 103.82,60.33 102.55,61.59 IC13.8 | IC2.8 102.55,39.37 103.82,40.64 103.82,46.35 102.55,47.62 IC17.8 | IC17.8 IC17.9 | IC13.8 IC13.9 | IC9.14 IC9.13 IC9.12 58.42,18.73 59.37,17.78 62.55,17.78 63.5,18.73 IC9.10 IC9.9 | IC1.9 IC1.8 133.35,39.37 134.62,40.64 134.62,46.35 135.89,47.62 IC16.9 135.89,53.34 134.62,54.61 134.62,60.33 135.89,61.59 IC12.9 135.89,67.31 134.62,68.58 134.62,74.3 133.35,75.56 IC5.8 133.35,81.28 134.62,82.55 134.62,90.81 | IC15.9 IC15.8 | IC19.8 IC19.9 | IC10.11 146.37,82.23 147.32,81.28 147.32,79.69 | 147.32,79.69 147.32,75.56 146.37,74.61 | IC10.14 146.37,74.61 | 146.37,74.61 147.32,73.66 147.32,70.48 146.37,69.53 IC10.16 | IC11.10 146.37,59.37 147.32,60.33 147.32,62.55 145.1,64.77 C3.1 | IC11.13 143.83,51.75 142.88,50.8 142.88,45.09 143.83,44.13 IC11.16 | IC11.3 156.21,49.21 | IC10.5 147.32,79.69
  Bottom 0.813: VCC1.1 VCC1.2 VCC1.4 | VCC1.4 VCC1.3 | VCC1.4 C20.+ 149.54,8.26 156.21,14.92 156.21,38.1 | C11.1 79.69,46.35 79.69,58.42 | 79.69,58.42 79.69,72.39 | 79.69,72.39 79.69,86.36 | 79.69,86.36 79.69,94.61 | C8.1 79.69,86.36 | C7.1 48.9,44.45 | 48.9,44.45 48.9,58.42 | 48.9,58.42 48.9,72.39 | 48.9,72.39 48.9,86.04 | 48.9,86.04 48.9,94.61 | C14.1 110.49,46.35 110.49,58.42 | 110.49,58.42 110.49,72.39 | 110.49,72.39 110.49,86.36 | 110.49,86.36 110.49,94.61 | C12.1 110.49,86.36 | 17.78,86.04 17.78,72.39 | 17.78,86.04 C16.1 20.64,86.36 IC8.20 | C19.1 48.9,86.04 | C5.1 48.9,72.39 | C6.1 48.9,58.42 | C9.1 79.69,72.39 | C10.1 79.69,58.42 | C1.1 110.49,72.39 | C13.1 110.49,58.42 | 156.21,38.1 156.21,49.21 v156.21,64.14 156.21,87.63 154.62,89.22 136.21,89.22 134.62,90.81 130.81,94.61 110.49,94.61 | 156.21,38.1 147.64,38.1 C2.1 IC11.16 | IC10.16 C3.1 | C18.1 17.78,46.67 17.78,58.42 | 17.78,58.42 17.78,72.39 | C4.1 17.78,72.39 | C17.1 17.78,58.42 | VCC2.3 VCC2.1 | VCC2.3 VCC2.4 | VCC2.4 VCC2.2 | IC9.14 C15.1 48.9,20.95 48.9,44.45 | 110.49,94.61 103.82,94.61 79.69,94.61 | 79.69,94.61 73.03,94.61 48.9,94.61 | 48.9,94.61 42.23,94.61 VCC2.4 | 17.78,86.04 11.75,92.08 VCC2.3
/CNTSP
  Top 0.406: IC11.2 151.45,46.67 148.27,43.5 148.27,16.19 144.78,12.7 127.64,12.7 124.46,9.53 JP10.3
  Bottom 0.406: IC10.3 151.45,74.61 150.5,73.66 150.5,68.26 151.76,66.99 151.76,65.09 149.54,62.87 149.54,48.58 151.45,46.67 IC11.2
/ENMAR
  Top 0.406: IC4.17 30.8,43.18 32.38,41.59 60.01,41.59 61.59,43.18 | IC3.17 61.59,43.18 | 61.59,43.18 63.18,41.59 90.81,41.59 92.39,43.18 | IC2.17 92.39,43.18 | 92.39,43.18 93.98,41.59 121.6,41.59 123.19,43.18 IC1.17
  Bottom 0.406: JP9.48 17.78,5.08 19.37,3.49 25.4,3.49 26.67,4.76 26.67,22.86 29.53,25.72 29.53,39.37 30.8,40.64 IC4.17
/ENPC
  Top 0.406: IC8.17 30.8,87.63 32.38,89.22 60.01,89.22 61.59,87.63 | IC7.17 61.59,87.63 | 61.59,87.63 63.18,89.22 90.81,89.22 92.39,87.63 | IC6.17 92.39,87.63 | 92.39,87.63 93.98,89.22 121.6,89.22 123.19,87.63 IC5.17
  Bottom 0.406: IC8.17 30.8,84.77 26.99,80.96 22.54,80.96 21.27,79.69 21.27,30.8 24.13,27.94 24.13,6.99 JP9.42
/ENSP
  Top 0.406: JP9.46 21.59,6.99 21.59,12.06 31.43,21.91 73.03,21.91 77.79,17.14 125.09,17.14 128.59,13.65 144.46,13.65 147.32,16.51 147.32,48.26 146.37,49.21 IC11.14
  Bottom 0.406: IC10.13 143.83,77.15 142.88,76.2 142.88,59.05 143.83,58.1 146.37,58.1 147.32,57.15 147.32,50.16 146.37,49.21 IC11.14
/FS
  Top 0.406: IC11.1 152.72,18.41 146.05,11.75 140.97,11.75 133.67,4.45 92.08,4.45 91.44,5.08 JP10.30
  Bottom 0.406: IC10.1 152.72,64.77 150.5,62.55 150.5,48.9 151.45,47.94 154.31,47.94 154.94,47.31 154.94,44.77 154.31,44.13 IC11.1
/INC_MAR
  Top 0.406: 69.22,38.1 66.67,40.64 40.96,40.64 38.42,38.1 IC4.7 | IC3.7 69.22,38.1 | 69.22,38.1 71.75,40.64 97.47,40.64 100.01,38.1 | IC2.7 100.01,38.1 | 100.01,38.1 102.55,40.64 126.68,40.64 128.59,38.73 130.18,38.73 130.81,38.1 IC1.7
  Bottom 0.406: IC4.7 38.42,18.41 36.83,16.83 36.83,6.99 JP9.32
/INCPC
  Top 0.406: 69.22,77.47 70.17,76.52 99.06,76.52 100.01,77.47 | IC6.7 100.01,77.47 | 100.01,77.47 100.97,76.52 129.86,76.52 130.81,77.47 IC5.7 | IC8.7 38.42,77.47 40.64,75.25 66.99,75.25 69.22,77.47 | 69.22,77.47 IC7.7
  Bottom 0.406: JP10.1 127,9.53 125.09,11.43 125.09,24.77 132.08,31.75 132.08,74.3 130.81,75.56 IC5.7
/LDMAR
  Top 0.406: JP9.23 48.26,10.16 50.48,12.38 IC9.1
  Bottom 0.406: IC9.1 53.34,13.34 54.61,14.61 59.69,14.61 60.96,13.34 IC9.4
/LDMARHI
  Top 0.406: JP9.17 57.15,9.53 61.91,9.53 63.5,11.11 IC9.5
/LDMARLO
  Bottom 0.406: JP9.18 54.61,6.99 54.61,9.53 55.88,10.79 IC9.2
/LDPC
  Top 0.406: IC8.11 46.04,85.09 46.99,84.14 75.88,84.14 76.83,85.09 | IC7.11 76.83,85.09 | 76.83,85.09 77.79,84.14 106.68,84.14 107.63,85.09 | IC6.11 107.63,85.09 | 107.63,85.09 108.58,84.14 137.48,84.14 138.43,85.09 IC5.11
  Bottom 0.406: IC8.11 46.04,85.09 44.77,83.82 44.77,16.83 JP9.19
/LDSP
  Top 0.406: IC11.5 153.99,54.29 154.94,53.34 154.94,19.37 146.37,10.79 141.29,10.79 133.99,3.49 82.87,3.49 80.01,6.35 80.01,8.89 74.3,14.61 55.56,14.61 54.61,13.65 54.61,10.79 53.66,9.84 52.39,9.84 JP9.21
  Bottom 0.406: IC10.6 153.99,82.23 154.94,81.28 154.94,55.24 153.99,54.29 IC11.5
/RST  (via drill 0.61 pad 1.27)
  Top 0.406: 105.09,79.69 106.36,80.96 110.17,80.96 111.44,79.69 113.35,79.69 114.62,80.96 134.94,80.96 135.89,80.01 IC5.9 | 74.3,80.01 75.25,80.96 79.38,80.96 80.64,79.69 82.55,79.69 83.82,80.96 103.82,80.96 105.09,79.69 | 105.09,79.69 IC6.9 | IC8.9 43.5,77.47 44.77,76.2 66.67,76.2 67.94,77.47 67.94,80.01 68.9,80.96 73.34,80.96 74.3,80.01 | 74.3,80.01 IC7.9 | JP10.7 119.38,9.53 113.35,15.56 v100.65,15.56
  Bottom 0.406: v100.65,15.56 100.65,25.4 103.82,28.57 103.82,39.05 106.36,41.59 106.36,74.3 105.09,75.56 IC6.9
ABUS0
  Top 0.406: JP2.1 140.65,37.78 138.75,39.69 128.91,39.69 125.73,42.86 IC1.16
  Bottom 0.406: IC5.16 125.73,82.55 124.46,81.28 124.46,75.56 125.73,74.3 IC12.16 125.73,68.58 124.46,67.31 124.46,61.59 125.73,60.33 IC16.16 125.73,54.61 124.46,53.34 124.46,47.62 125.73,46.35 IC1.16
ABUS1
  Top 0.406: JP2.2 143.19,37.78 139.38,41.59 133.67,41.59 132.08,43.18 132.08,45.72 131.13,46.67 129.22,46.67 128.27,45.72 IC1.15
  Bottom 0.406: IC5.15 128.27,82.55 127,81.28 127,75.56 128.27,74.3 IC12.15 128.27,68.58 127,67.31 127,61.59 128.27,60.33 IC16.15 128.27,54.61 127,53.34 127,47.62 128.27,46.35 IC1.15
ABUS2
  Top 0.406: JP2.3 141.92,32.38 141.92,37.78 139.06,40.64 133.03,40.64 130.81,42.86 IC1.14
  Bottom 0.406: IC5.14 130.81,82.55 129.54,81.28 129.54,75.56 130.81,74.3 IC12.14 130.81,68.58 129.54,67.31 129.54,61.59 130.81,60.33 IC16.14 130.81,54.61 129.54,53.34 129.54,47.62 130.81,46.35 IC1.14
ABUS3
  Top 0.406: IC1.13 133.35,43.18 133.99,42.55 139.7,42.55 144.46,37.78 144.46,32.38 JP2.4
  Bottom 0.406: IC5.13 133.35,82.55 132.08,81.28 132.08,75.56 133.35,74.3 IC12.13 133.35,68.58 134.62,67.31 134.62,61.59 133.35,60.33 IC16.13 133.35,54.61 134.62,53.34 134.62,47.62 133.35,46.35 IC1.13
ABUS4  (via drill 0.61 pad 1.27)
  Top 0.406: v93.66,33.34 98.42,28.57 JP2.5
  Bottom 0.406: IC6.16 94.93,82.55 93.66,81.28 93.66,75.56 94.93,74.3 IC13.16 94.93,68.58 93.66,67.31 93.66,61.59 94.93,60.33 IC17.16 94.93,54.61 93.66,53.34 93.66,47.62 94.93,46.35 IC2.16 94.93,40.64 93.66,39.37 v93.66,33.34
ABUS5  (via drill 0.61 pad 1.27)
  Top 0.406: v96.2,33.34 99.69,29.84 141.92,29.84 JP2.6
  Bottom 0.406: IC6.15 97.47,82.55 96.2,81.28 96.2,75.56 97.47,74.3 IC13.15 97.47,68.58 96.2,67.31 96.2,61.59 97.47,60.33 IC17.15 97.47,54.61 96.2,53.34 96.2,47.62 97.47,46.35 IC2.15 97.47,40.64 96.2,39.37 v96.2,33.34
ABUS6  (via drill 0.61 pad 1.27)
  Top 0.406: v98.74,33.34 100.97,31.11 v133.67,31.11
  Bottom 0.406: IC6.14 100.01,82.55 98.74,81.28 98.74,75.56 100.01,74.3 IC13.14 100.01,68.58 98.74,67.31 98.74,61.59 100.01,60.33 IC17.14 100.01,54.61 98.74,53.34 98.74,47.62 100.01,46.35 IC2.14 100.01,40.64 98.74,39.37 v98.74,33.34 | v133.67,31.11 133.67,28.57 136.21,26.04 JP2.7
ABUS7  (via drill 0.61 pad 1.27)
  Top 0.406: v101.28,33.34 102.23,32.38 v135.25,32.38
  Bottom 0.406: IC6.13 102.55,82.55 101.28,81.28 101.28,75.56 102.55,74.3 IC13.13 102.55,68.58 101.28,67.31 101.28,61.59 102.55,60.33 IC17.13 102.55,54.61 101.28,53.34 101.28,47.62 102.55,46.35 IC2.13 102.55,40.64 101.28,39.37 v101.28,33.34 | v135.25,32.38 135.25,29.84 137.79,27.3 141.92,27.3 JP2.8
ABUS8  (via drill 0.61 pad 1.27)
  Top 0.406: v62.87,33.34 69.53,26.67 74.93,26.67 78.11,23.5 JP2.9
  Bottom 0.406: v62.87,33.34 62.87,39.37 64.14,40.64 IC3.16 64.14,46.35 62.87,47.62 62.87,53.34 64.14,54.61 IC18.16 64.14,60.33 62.87,61.59 62.87,67.31 64.14,68.58 IC14.16 64.14,74.3 62.87,75.56 62.87,81.28 64.14,82.55 IC7.16
ABUS9  (via drill 0.61 pad 1.27)
  Top 0.406: v65.41,33.34 71.12,27.62 75.25,27.62 78.11,24.77 141.92,24.77 JP2.10
  Bottom 0.406: v65.41,33.34 65.41,39.37 66.67,40.64 IC3.15 66.67,46.35 65.41,47.62 65.41,53.34 66.67,54.61 IC18.15 66.67,60.33 65.41,61.59 65.41,67.31 66.67,68.58 IC14.15 66.67,74.3 65.41,75.56 65.41,81.28 66.67,82.55 IC7.15
ABUS10  (via drill 0.61 pad 1.27)
  Top 0.406: v67.94,33.34 72.71,28.57 75.56,28.57 78.11,26.04 v130.49,26.04
  Bottom 0.406: v67.94,33.34 67.94,39.37 69.22,40.64 IC3.14 69.22,46.35 67.94,47.62 67.94,53.34 69.22,54.61 IC18.14 69.22,60.33 67.94,61.59 67.94,67.31 69.22,68.58 IC14.14 69.22,74.3 67.94,75.56 67.94,81.28 69.22,82.55 IC7.14 | v130.49,26.04 130.49,23.5 133.03,20.95 JP2.11
ABUS11  (via drill 0.61 pad 1.27)
  Top 0.406: v70.48,33.34 74.3,29.53 75.88,29.53 78.11,27.3 v132.4,27.3
  Bottom 0.406: v70.48,33.34 70.48,39.37 71.75,40.64 IC3.13 71.75,46.35 70.48,47.62 70.48,53.34 71.75,54.61 IC18.13 71.75,60.33 70.48,61.59 70.48,67.31 71.75,68.58 IC14.13 71.75,74.3 70.48,75.56 70.48,81.28 71.75,82.55 IC7.13 | JP2.12 141.92,22.23 134.94,22.23 132.4,24.77 v132.4,27.3
ABUS12  (via drill 0.61 pad 1.27)
  Top 0.406: v32.07,31.11 40.32,22.86 73.66,22.86 78.11,18.41 JP2.13
  Bottom 0.406: v32.07,31.11 32.07,39.37 33.34,40.64 IC4.16 33.34,46.35 32.07,47.62 32.07,53.34 33.34,54.61 IC19.16 33.34,60.33 32.07,61.59 32.07,67.31 33.34,68.58 IC15.16 33.34,74.3 32.07,75.56 32.07,81.28 33.34,82.55 IC8.16
ABUS13  (via drill 0.61 pad 1.27)
  Top 0.406: v34.61,31.11 41.91,23.81 73.98,23.81 78.11,19.68 141.92,19.68 JP2.14
  Bottom 0.406: v34.61,31.11 34.61,39.37 35.88,40.64 IC4.15 35.88,46.35 34.61,47.62 34.61,53.34 35.88,54.61 IC19.15 35.88,60.33 34.61,61.59 34.61,67.31 35.88,68.58 IC15.15 35.88,74.3 34.61,75.56 34.61,81.28 35.88,82.55 IC8.15
ABUS14  (via drill 0.61 pad 1.27)
  Top 0.406: v37.15,31.11 43.5,24.77 74.3,24.77 78.11,20.95 v126.68,20.95
  Bottom 0.406: v37.15,31.11 37.15,39.37 38.42,40.64 IC4.14 38.42,46.35 37.15,47.62 37.15,53.34 38.42,54.61 IC19.14 38.42,60.33 37.15,61.59 37.15,67.31 38.42,68.58 IC15.14 38.42,74.3 37.15,75.56 37.15,81.28 38.42,82.55 IC8.14 | JP2.15 129.22,15.88 126.68,18.41 v126.68,20.95
ABUS15  (via drill 0.61 pad 1.27)
  Top 0.406: v39.69,31.11 45.09,25.72 74.61,25.72 78.11,22.23 v128.59,22.23
  Bottom 0.406: v39.69,31.11 39.69,39.37 40.96,40.64 IC4.13 40.96,46.35 39.69,47.62 39.69,53.34 40.96,54.61 IC19.13 40.96,60.33 39.69,61.59 39.69,67.31 40.96,68.58 IC15.13 40.96,74.3 39.69,75.56 39.69,81.28 40.96,82.55 IC8.13 | JP2.16 141.92,17.14 131.13,17.14 128.59,19.68 v128.59,22.23
ALUBUS0  (via drill 0.61 pad 1.27)
  Top 0.406: v119.38,92.08 116.2,95.25 21.27,95.25 11.75,85.72 6.03,85.72 JP3.1
  Bottom 0.406: v119.38,92.08 119.38,82.55 120.65,81.28 IC5.3 120.65,75.56 121.92,74.3 121.92,68.58 120.65,67.31 IC12.3 120.65,61.59 121.92,60.33 121.92,54.61 120.65,53.34 IC16.3 120.65,47.62 121.92,46.35 121.92,40.64 120.65,39.37 IC1.3
ALUBUS1  (via drill 0.61 pad 1.27)
  Top 0.406: v121.92,92.08 117.79,96.2 20.95,96.2 11.43,86.68 4.13,86.68 3.49,86.04 3.49,83.82 4.13,83.19 6.03,83.19 JP3.2
  Bottom 0.406: v121.92,92.08 121.92,82.55 123.19,81.28 IC5.4 123.19,75.56 124.46,74.3 124.46,68.58 123.19,67.31 IC12.4 123.19,61.59 124.46,60.33 124.46,54.61 123.19,53.34 IC16.4 123.19,47.62 124.46,46.35 124.46,40.64 123.19,39.37 IC1.4
ALUBUS2  (via drill 0.61 pad 1.27)
  Top 0.406: v127,92.08 121.92,97.16 20.64,97.16 11.11,87.63 3.81,87.63 2.54,86.36 2.54,83.19 3.81,81.92 JP3.3
  Bottom 0.406: IC1.5 125.73,39.37 127,40.64 127,46.35 125.73,47.62 IC16.5 125.73,53.34 127,54.61 127,60.33 125.73,61.59 IC12.5 125.73,67.31 127,68.58 127,74.3 125.73,75.56 IC5.5 125.73,81.28 127,82.55 v127,92.08
ALUBUS3  (via drill 0.61 pad 1.27)
  Top 0.406: v129.54,92.08 123.51,98.11 20.32,98.11 10.79,88.58 3.49,88.58 1.59,86.68 1.59,82.87 3.81,80.64 6.03,80.64 JP3.4
  Bottom 0.406: IC1.6 128.27,39.37 129.54,40.64 129.54,46.35 128.27,47.62 IC16.6 128.27,53.34 129.54,54.61 129.54,60.33 128.27,61.59 IC12.6 128.27,67.31 129.54,68.58 129.54,74.3 128.27,75.56 IC5.6 128.27,81.28 129.54,82.55 v129.54,92.08
ALUBUS4  (via drill 0.61 pad 1.27)
  Top 0.406: v88.58,90.49 22.54,90.49 10.16,78.11 6.03,78.11 JP3.5
  Bottom 0.406: v88.58,90.49 88.58,82.55 89.85,81.28 IC6.3 89.85,75.56 91.12,74.3 91.12,68.58 89.85,67.31 IC13.3 89.85,61.59 91.12,60.33 91.12,54.61 89.85,53.34 IC17.3 89.85,47.62 91.12,46.35 91.12,40.64 89.85,39.37 IC2.3
ALUBUS5  (via drill 0.61 pad 1.27)
  Top 0.406: v91.12,91.76 22.54,91.76 10.16,79.38 JP3.6
  Bottom 0.406: v91.12,91.76 91.12,82.55 92.39,81.28 IC6.4 92.39,75.56 93.66,74.3 93.66,68.58 92.39,67.31 IC13.4 92.39,61.59 93.66,60.33 93.66,54.61 92.39,53.34 IC17.4 92.39,47.62 93.66,46.35 93.66,40.64 92.39,39.37 IC2.4
ALUBUS6  (via drill 0.61 pad 1.27)
  Top 0.406: v10.79,82.23 11.75,82.23 22.86,93.34 94.93,93.34 v96.2,92.08
  Bottom 0.406: JP3.7 6.03,78.11 9.21,78.11 10.79,79.69 v10.79,82.23 10.79,80.64 | IC2.5 94.93,39.37 96.2,40.64 96.2,46.35 94.93,47.62 IC17.5 94.93,53.34 96.2,54.61 96.2,60.33 94.93,61.59 IC13.5 94.93,67.31 96.2,68.58 96.2,74.3 94.93,75.56 IC6.5 94.93,81.28 96.2,82.55 v96.2,92.08
ALUBUS7  (via drill 0.61 pad 1.27)
  Top 0.406: v9.53,83.82 12.06,83.82 22.54,94.3 96.52,94.3 v98.74,92.08
  Bottom 0.406: IC2.6 97.47,39.37 98.74,40.64 98.74,46.35 97.47,47.62 IC17.6 97.47,53.34 98.74,54.61 98.74,60.33 97.47,61.59 IC13.6 97.47,67.31 98.74,68.58 98.74,74.3 97.47,75.56 IC6.6 97.47,81.28 98.74,82.55 v98.74,92.08 | JP3.8 6.03,75.56 3.81,75.56 2.86,76.52 2.86,79.69 3.81,80.64 8.26,80.64 9.53,81.92 v9.53,83.82
ALUBUS8
  Top 0.406: JP3.9 6.03,73.03 9.84,73.03 19.05,82.23 43.18,82.23 44.45,80.96 48.26,80.96 49.85,79.38 51.75,79.38 53.34,80.96 58.1,80.96 59.05,80.01 IC7.3
  Bottom 0.406: IC7.3 59.05,75.56 60.33,74.3 60.33,69.85 59.05,68.58 IC14.3 59.05,61.59 60.33,60.33 60.33,54.61 59.05,53.34 IC18.3 59.05,47.62 60.33,46.35 60.33,40.96 59.05,39.69 IC3.3
ALUBUS9
  Top 0.406: IC7.4 61.59,80.01 59.37,82.23 44.45,82.23 43.5,83.19 18.41,83.19 9.53,74.3 JP3.10
  Bottom 0.406: IC7.4 61.59,75.56 62.87,74.3 62.87,69.85 61.59,68.58 IC14.4 61.59,61.59 62.87,60.33 62.87,54.61 61.59,53.34 IC18.4 61.59,47.62 62.87,46.35 62.87,40.64 61.59,39.37 IC3.4
ALUBUS10
  Top 0.406: JP3.11 3.49,71.75 1.91,70.17 1.91,59.05 20.32,40.64 29.84,40.64 32.07,38.42 32.07,35.56 33.02,34.61 48.9,34.61 53.98,39.69 62.55,39.69 64.14,38.1 IC3.5
  Bottom 0.406: IC7.5 64.14,75.56 65.41,74.3 65.41,68.58 64.14,67.31 IC14.5 64.14,61.59 65.41,60.33 65.41,54.61 64.14,53.34 IC18.5 64.14,47.62 65.41,46.35 65.41,40.64 64.14,39.37 IC3.5
ALUBUS11  (via drill 0.61 pad 1.27)
  Top 0.406: v10.16,76.83 17.46,84.14 43.81,84.14 44.77,83.19 63.5,83.19 66.67,80.01 IC7.6
  Bottom 0.406: IC7.6 66.67,75.56 67.94,74.3 67.94,68.58 66.67,67.31 IC14.6 66.67,61.59 67.94,60.33 67.94,54.61 66.67,53.34 IC18.6 66.67,47.62 67.94,46.35 67.94,40.64 66.67,39.37 IC3.6 | JP3.12 8.57,71.75 10.16,73.34 v10.16,76.83
ALUBUS12
  Top 0.406: JP3.13 3.49,69.22 2.86,68.58 2.86,62.55 17.14,48.26 23.5,48.26 24.45,49.21 24.45,52.07 25.4,53.02 27.3,53.02 28.26,52.07 IC19.3
  Bottom 0.406: IC8.3 28.26,75.56 29.53,74.3 29.53,68.58 28.26,67.31 IC15.3 28.26,61.59 29.53,60.33 29.53,54.61 28.26,53.34 IC19.3 28.26,47.62 29.53,46.35 29.53,40.64 28.26,39.37 IC4.3
ALUBUS13
  Top 0.406: JP3.14 13.97,69.22 20.64,62.55 29.84,62.55 30.8,63.5 IC15.4
  Bottom 0.406: IC8.4 30.8,75.56 32.07,74.3 32.07,68.58 30.8,67.31 IC15.4 30.8,61.59 32.07,60.33 32.07,54.61 30.8,53.34 IC19.4 30.8,47.62 32.07,46.35 32.07,40.64 30.8,39.37 IC4.4
ALUBUS14
  Top 0.406: JP3.15 6.03,67.94 13.97,67.94 20.32,61.59 31.43,61.59 33.34,63.5 IC15.5
  Bottom 0.406: IC8.5 33.34,75.56 34.61,74.3 34.61,68.58 33.34,67.31 IC15.5 33.34,61.59 34.61,60.33 34.61,54.61 33.34,53.34 IC19.5 33.34,47.62 34.61,46.35 34.61,40.64 33.34,39.37 IC4.5
ALUBUS15
  Top 0.406: JP3.16 13.97,66.67 20,60.64 31.75,60.64 33.66,62.55 35.24,62.55 35.88,63.18 IC15.6 35.88,63.5
  Bottom 0.406: IC8.6 35.88,75.56 37.15,74.3 37.15,68.58 35.88,67.31 IC15.6 35.88,61.59 37.15,60.33 37.15,54.61 35.88,53.34 IC19.6 35.88,47.62 37.15,46.35 37.15,40.64 35.88,39.37 IC4.6
CLK0B  (via drill 0.61 pad 1.27)
  Top 0.406: IC4.2 25.72,35.56 27.62,33.66 54.61,33.66 56.52,35.56 | IC1.2 118.11,35.56 116.2,33.66 v110.49,33.66 103.5,33.66 102.55,34.61 88.27,34.61 87.31,35.56 | IC2.2 87.31,35.56 | 87.31,35.56 86.36,34.61 57.47,34.61 56.52,35.56 | 56.52,35.56 IC3.2
  Bottom 0.406: IC8.2 25.72,75.56 24.45,74.3 24.45,40.64 25.72,39.37 IC4.2 | IC7.2 56.52,75.56 55.24,74.3 55.24,40.64 56.52,39.37 IC3.2 | IC6.2 87.31,75.56 86.04,74.3 86.04,40.64 87.31,39.37 IC2.2 | IC5.2 118.11,75.56 116.84,74.3 116.84,40.64 118.11,39.37 IC1.2 | JP10.18 107.95,6.99 107.95,11.75 110.49,14.29 v110.49,33.66
CLK0C
  Top 0.406: IC16.2 118.11,49.21 116.52,47.62 89.22,47.62 87.31,49.53 | IC19.2 25.72,49.21 27.3,47.62 54.61,47.62 56.52,49.53 | IC17.2 87.31,49.53 | IC18.2 56.52,49.53 | 87.31,49.53 85.41,47.62 58.42,47.62 56.52,49.53
  Bottom 0.406: IC15.2 25.72,61.59 26.99,60.33 26.99,54.61 25.72,53.34 IC19.2 | IC14.2 56.52,61.59 57.78,60.33 57.78,54.61 56.52,53.34 IC18.2 | IC13.2 87.31,61.59 88.58,60.33 88.58,54.61 87.31,53.34 IC17.2 | IC12.2 118.11,61.59 119.38,60.33 119.38,54.61 118.11,53.34 IC16.2 118.11,47.62 119.38,46.35 119.38,35.56 118.75,34.92 109.22,34.92 107.31,33.02 107.31,12.7 104.14,9.53 JP10.19
GND
  pour Bottom (isolate 0.61): 0,100.01 160.02,100.01 160.02,89.22 160.02,0 0,0
  pour Top (isolate 0.61): 0,100.01 160.02,100.01 160.02,0 0,0
N$1
  Top 0.406: IC2.11 107.63,45.4 108.9,46.67 127.32,46.67 128.27,47.62 136.53,47.62 138.43,45.72 IC1.11
  Bottom 0.406: IC9.3 58.42,11.11 59.05,10.48 97.79,10.48 106.36,19.05 106.36,39.37 107.63,40.64 IC2.11
N$2
  Top 0.406: IC7.12 74.3,87.63 74.93,88.27 86.68,88.27 87.31,87.63 IC6.19
N$3
  Top 0.406: IC6.12 105.09,87.63 105.73,88.27 117.47,88.27 118.11,87.63 IC5.19
N$4
  Top 0.406: IC8.12 43.5,87.63 44.13,88.27 55.88,88.27 56.52,87.63 IC7.19
N$5
  Top 0.406: IC13.12 105.09,71.12 106.05,70.17 117.16,70.17 118.11,71.12 IC12.19
N$6
  Top 0.406: IC14.12 74.3,71.12 75.25,70.17 86.36,70.17 87.31,71.12 IC13.19
N$7
  Top 0.406: IC4.11 46.04,45.72 46.99,46.67 75.88,46.67 76.83,45.72 IC3.11
  Bottom 0.406: IC9.6 66.04,13.34 75.56,22.86 75.56,39.37 76.83,40.64 IC3.11
N$8
  Top 0.406: IC15.12 43.5,71.12 44.45,70.17 55.56,70.17 56.52,71.12 IC14.19
N$9
  Top 0.406: IC15.7 38.42,63.5 39.37,62.55 68.26,62.55 69.22,63.5 | IC14.7 69.22,63.5 | 69.22,63.5 70.17,62.55 99.06,62.55 100.01,63.5 | IC13.7 100.01,63.5 | 100.01,63.5 100.97,62.55 129.86,62.55 130.81,63.5 IC12.7 130.81,66.04 131.76,66.99 141.6,66.99 142.56,67.94 142.56,74.93 143.51,75.88 148.91,75.88 150.18,77.15 IC10.4
N$10
  Top 0.406: IC2.12 105.09,43.18 105.73,42.55 117.47,42.55 118.11,43.18 IC1.19
N$11
  Top 0.406: IC3.12 74.3,43.18 74.93,42.55 86.68,42.55 87.31,43.18 IC2.19
N$12
  Top 0.406: IC4.12 43.5,43.18 44.13,42.55 55.88,42.55 56.52,43.18 IC3.19
N$13
  Top 0.406: 76.83,73.66 77.79,74.61 106.68,74.61 107.63,73.66 | IC13.11 107.63,73.66 | 107.63,73.66 108.58,74.61 137.48,74.61 138.43,73.66 | 138.43,73.66 IC12.11 | IC14.11 76.83,73.66 | 76.83,73.66 76.2,74.3 46.67,74.3 46.04,73.66 IC15.11 | 138.43,73.66 140.34,75.56 140.34,78.42 142.88,80.96 146.69,80.96 150.5,84.77 151.13,84.77 151.76,84.77 IC10.7
N$14  (via drill 0.61 pad 1.27)
  Top 0.406: IC15.1 23.18,66.04 24.13,66.99 46.99,66.99 49.21,64.77 IC14.1 53.98,66.04 54.93,66.99 78.11,66.99 80.33,64.77 IC13.1 84.77,66.04 85.72,66.99 110.17,66.99 112.39,64.77 IC12.1 115.57,66.04 117.79,68.26 v140.65,68.26
  Bottom 0.406: v140.65,68.26 140.65,85.09 142.88,87.31 IC10.9
N$15
  Top 0.406: IC19.1 23.18,52.07 25.08,53.98 47.31,53.98 50.48,50.8 IC18.1 53.98,52.07 55.88,53.98 78.11,53.98 81.28,50.8 IC17.1 84.77,52.07 86.68,53.98 108.9,53.98 112.08,50.8 IC16.1 115.57,52.07 117.47,53.98 138.75,53.98 141.92,57.15 141.92,60.64 143.19,61.91 IC11.9
N$16
  Top 0.406: IC15.17 30.8,71.12 32.7,69.22 59.69,69.22 61.59,71.12 | IC14.17 61.59,71.12 | 61.59,71.12 63.5,69.22 90.49,69.22 92.39,71.12 | IC13.17 92.39,71.12 | 92.39,71.12 94.3,69.22 121.28,69.22 123.19,71.12 | IC12.17 123.19,71.12 | 123.19,71.12 125.09,69.22 139.06,69.22 141.29,71.44 141.29,78.11 142.88,79.69 IC10.12
N$17
  Top 0.406: IC19.17 33.97,61.59 59.69,61.59 61.59,59.69 | IC18.17 61.59,59.69 | 61.59,59.69 63.5,61.59 90.81,61.59 92.39,60.01 | IC17.17 92.39,60.01 | 92.39,60.01 93.98,61.59 121.28,61.59 123.19,59.69 | IC16.17 123.19,59.69 | 123.19,59.69 125.09,61.59 141.6,61.59 143.51,63.5 146.05,63.5 147.32,62.23 147.32,55.24 146.37,54.29 IC11.12
N$19
  Top 0.406: IC17.12 105.09,59.69 106.05,60.64 117.16,60.64 118.11,59.69 IC16.19
N$20
  Top 0.406: IC18.12 74.3,59.69 75.25,60.64 86.36,60.64 87.31,59.69 IC17.19
N$21
  Top 0.406: IC19.12 43.5,59.69 44.45,60.64 55.56,60.64 56.52,59.69 IC18.19
N$23
  Top 0.406: IC19.7 38.42,49.53 39.37,48.58 54.29,48.58 55.24,49.53 55.24,52.07 56.2,53.02 68.26,53.02 69.22,52.07 IC18.7 69.22,49.53 70.17,48.58 85.09,48.58 86.04,49.53 86.04,52.07 87,53.02 99.06,53.02 100.01,52.07 IC17.7 100.01,49.53 100.97,48.58 115.89,48.58 116.84,49.53 116.84,52.07 117.79,53.02 129.86,53.02 130.81,52.07 | 130.81,52.07 IC16.7 | 130.81,52.07 131.76,53.02 148.91,53.02 150.18,51.75 IC11.4
N$24  (via drill 0.61 pad 1.27)
  Top 0.406: IC19.11 46.04,57.15 46.99,56.2 75.88,56.2 76.83,57.15 | IC18.11 76.83,57.15 | 76.83,57.15 77.79,56.2 106.68,56.2 107.63,57.15 | IC17.11 107.63,57.15 | 107.63,57.15 108.58,56.2 137.48,56.2 138.43,57.15 IC16.11 | IC11.7 151.45,59.37 146.37,64.45 v140.65,64.45
  Bottom 0.406: v140.65,64.45 140.65,60.64 IC16.11
SP_DIR
  Bottom 0.406: IC10.10 143.83,84.77 141.92,82.87 141.92,58.74 143.83,56.83 IC11.11 143.51,56.83 141.92,55.24 141.92,40.32 145.73,36.51 145.73,14.29 143.51,12.06 138.11,12.06 130.18,4.13 105.09,4.13 104.14,5.08 JP10.20

### Text on the board
Top: #7
tsilk: VCC2 | GND1 | JP3 | 74LS569 | 74LS569 | 74LS569 | 74LS569 | IC8 | IC7 | IC6 | IC5 | 74LS157N | 74LS569 | 74LS569 | 74LS569 | 74LS569 | IC10 | IC15 | IC14 | IC13 | IC12 | 74LS569 | 74LS569 | 74LS569 | 74LS569 | IC19 | IC18 | IC17 | IC16 | 74LS157N | IC11 | 74LS569 | 74LS569 | 74LS569 | 74LS569 | IC4 | IC3 | IC2 | IC1 | JP2 | 74LS08N | C20 | 10u | IC9 | GND2 | VCC1 | JP9 | JP10